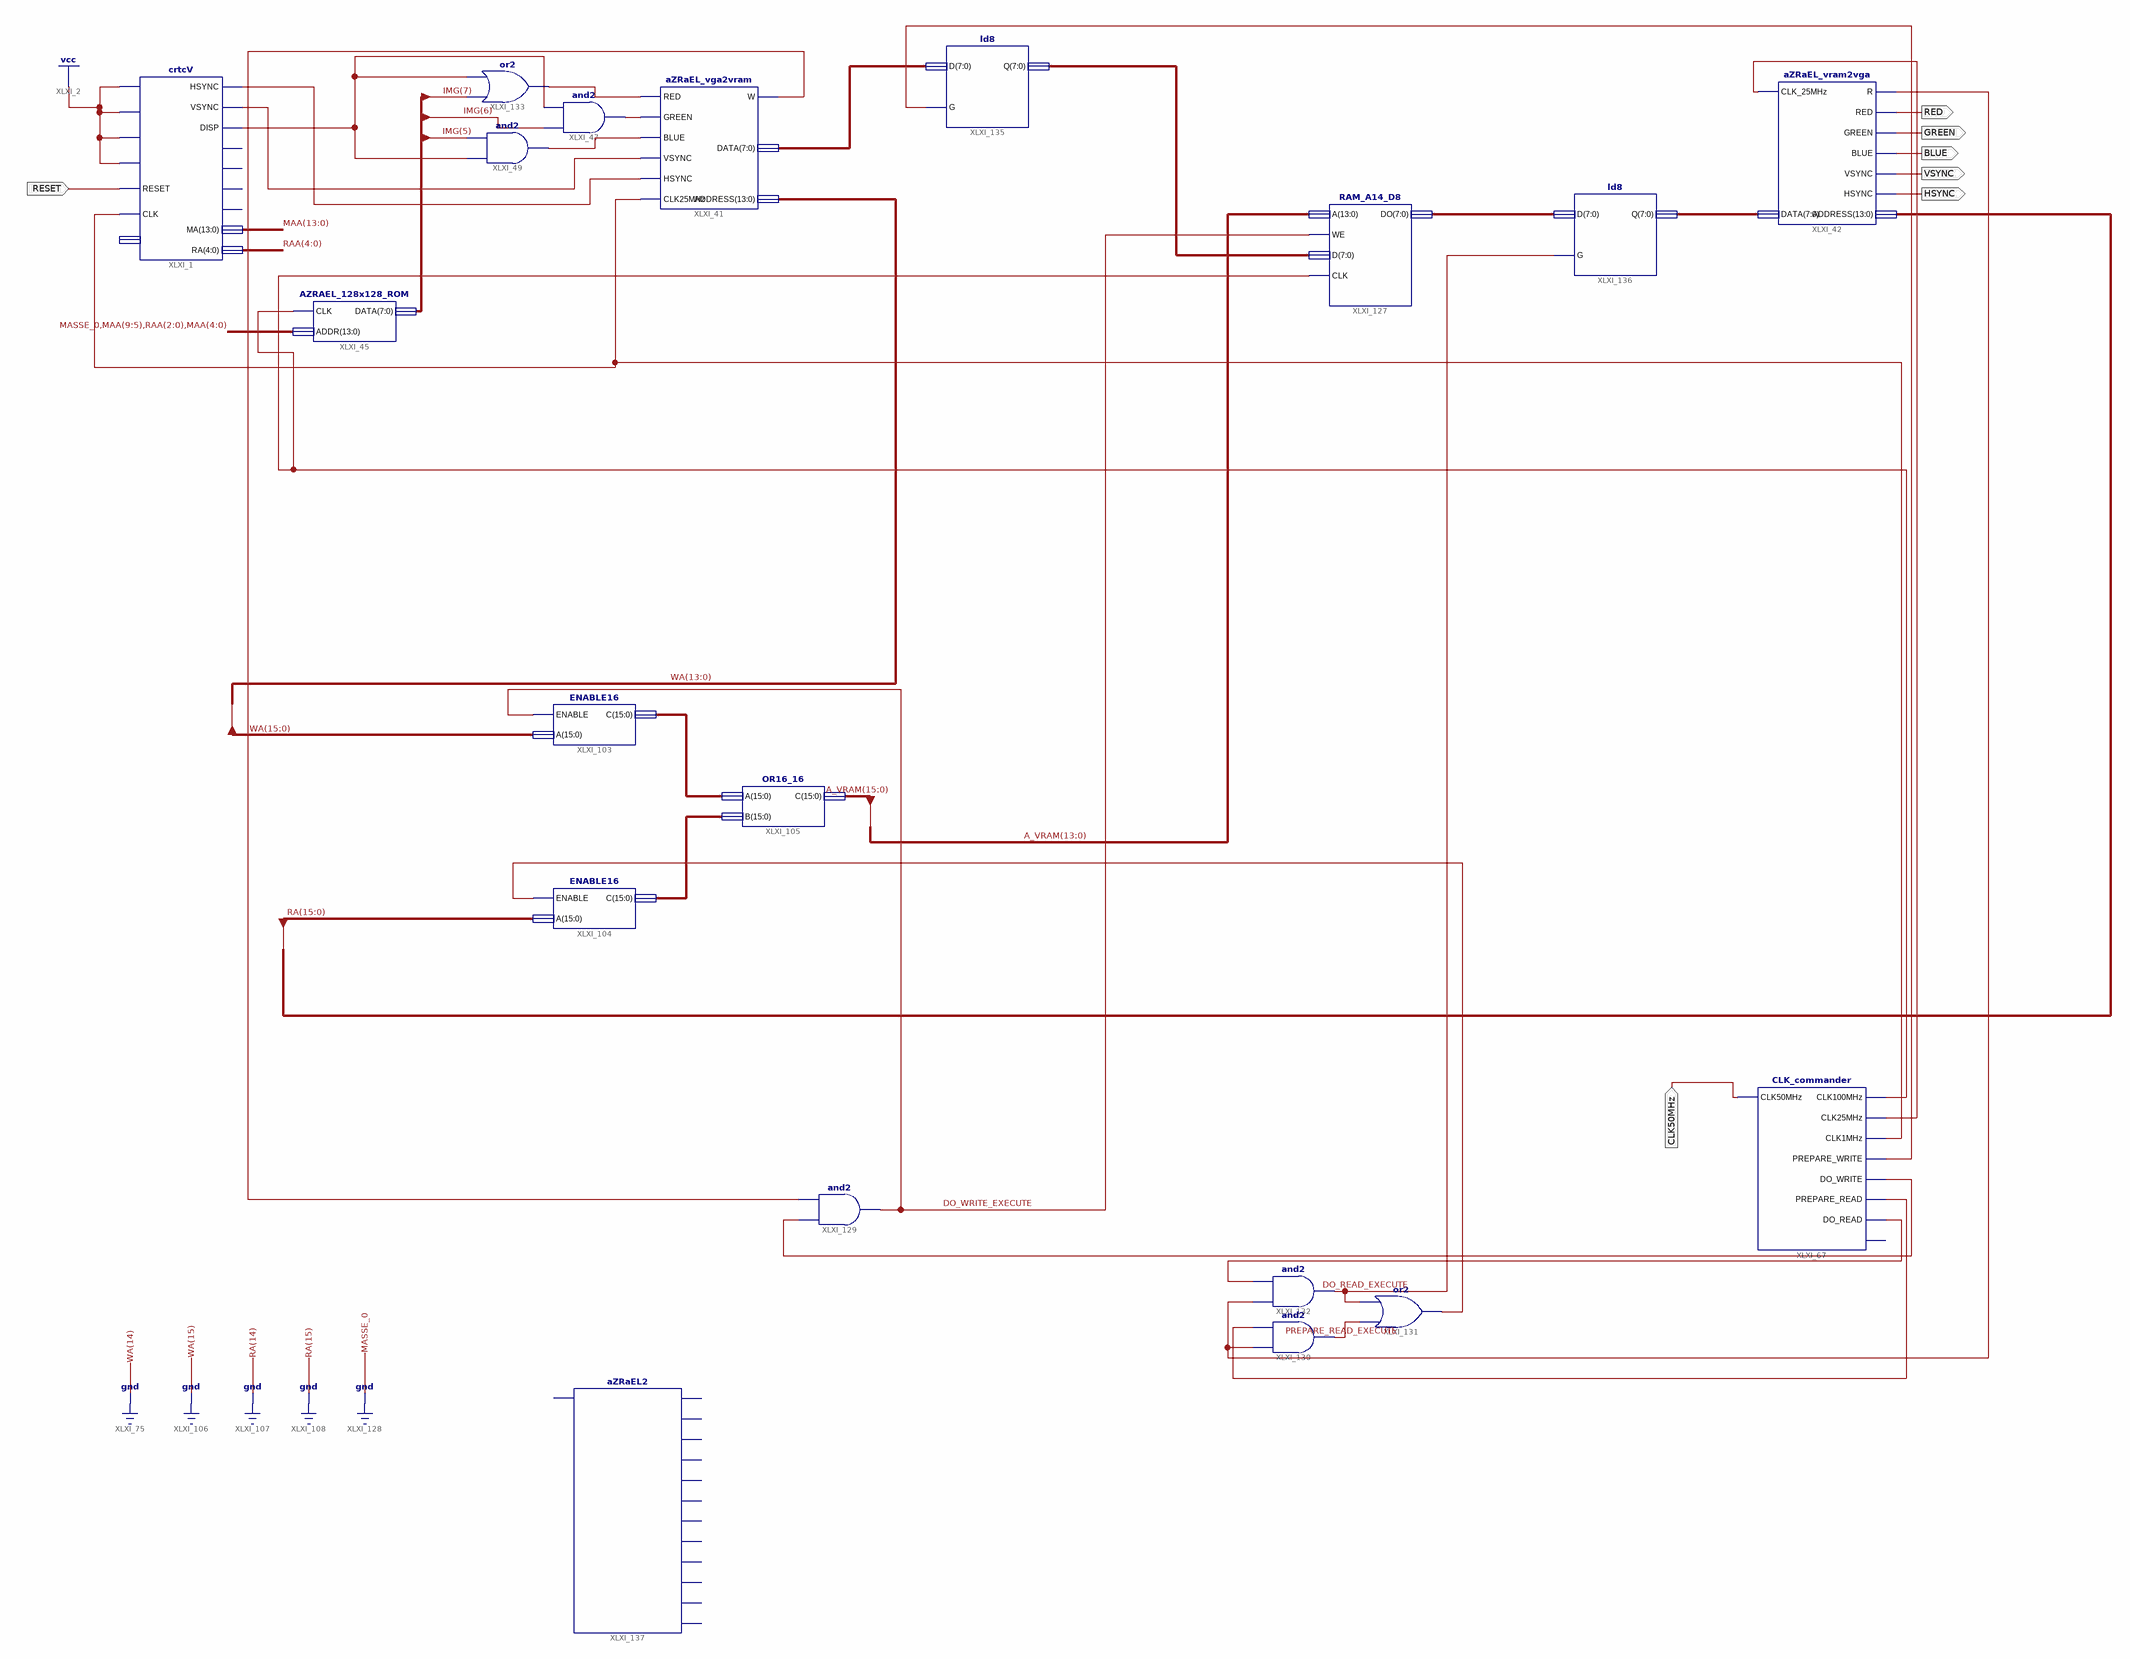
[diagram p0: schematic sheet 1]
// Xilinx ISE schematic aZRaEL_CRTC.sch (spartan3) as structural Verilog: 19 symbols, 7 ports
module aZRaEL_CRTC (
  input  RESET,
  input  CLK50MHz,
  output RED,
  output GREEN,
  output BLUE,
  output VSYNC,
  output HSYNC
);

  wire DO_READ_EXECUTE, DO_WRITE_EXECUTE, PREPARE_READ_EXECUTE, XLXN_81, XLXN_82, XLXN_89, XLXN_90, XLXN_91,
       XLXN_92, XLXN_139, XLXN_141, XLXN_183, XLXN_245, XLXN_246, XLXN_248, XLXN_251, XLXN_253, XLXN_254,
       XLXN_258;
  wire [4:0] RAA;
  wire [7:0] IMG, XLXN_162, XLXN_163, XLXN_238, XLXN_243;
  wire [13:0] MAA, RA, WA;
  wire [15:0] A_VRAM, XLXN_229, XLXN_230;

  crtcV XLXI_1 (
    .IOCLK(1'b1), .RS(1'b1), .CS(1'b1), .RW(1'b1), .RESET(RESET), .CLK(XLXN_139), .HSYNC(XLXN_82),
    .VSYNC(XLXN_81), .DISP(XLXN_92), .MA(MAA), .RA(RAA));  // open: Din, CPCHSYNC, CPCVSYNC, CPCDISP, CPCBLACK
  aZRaEL_vga2vram XLXI_41 (
    .RED(XLXN_91), .GREEN(XLXN_89), .BLUE(XLXN_90), .VSYNC(XLXN_81), .HSYNC(XLXN_82), .CLK25MHz(XLXN_139),
    .W(XLXN_245), .DATA(XLXN_243), .ADDRESS(WA));
  AZRAEL_128x128_ROM XLXI_45 (.CLK(XLXN_183), .ADDR({1'b0, MAA[9:5], RAA[2:0], MAA[4:0]}), .DATA(IMG));
  and XLXI_47 (XLXN_89, IMG[6], XLXN_92);
  and XLXI_49 (XLXN_90, XLXN_92, IMG[5]);
  CLK_commander XLXI_67 (
    .CLK50MHz(CLK50MHz), .CLK100MHz(XLXN_183), .CLK25MHz(XLXN_141), .CLK1MHz(XLXN_139),
    .PREPARE_WRITE(XLXN_258), .DO_WRITE(XLXN_246), .PREPARE_READ(XLXN_248), .DO_READ(XLXN_254));  // open: CLK4MHz
  aZRaEL_vram2vga XLXI_42 (
    .CLK_25MHz(XLXN_141), .DATA(XLXN_162), .R(XLXN_253), .RED(RED), .GREEN(GREEN), .BLUE(BLUE),
    .VSYNC(VSYNC), .HSYNC(HSYNC), .ADDRESS(RA));
  ENABLE16 XLXI_104 (.ENABLE(XLXN_251), .A({2'b00, RA}), .C(XLXN_230));
  ENABLE16 XLXI_103 (.ENABLE(DO_WRITE_EXECUTE), .A({2'b00, WA}), .C(XLXN_229));
  OR16_16 XLXI_105 (.A(XLXN_229), .B(XLXN_230), .C(A_VRAM));
  RAM_A14_D8 XLXI_127 (.D(XLXN_238), .A(A_VRAM[13:0]), .CLK(XLXN_183), .WE(DO_WRITE_EXECUTE), .DO(XLXN_163));
  and XLXI_129 (DO_WRITE_EXECUTE, XLXN_246, XLXN_245);
  and XLXI_130 (PREPARE_READ_EXECUTE, XLXN_253, XLXN_248);
  or XLXI_131 (XLXN_251, PREPARE_READ_EXECUTE, DO_READ_EXECUTE);
  and XLXI_132 (DO_READ_EXECUTE, XLXN_253, XLXN_254);
  or XLXI_133 (XLXN_91, IMG[7], XLXN_92);
  ld8 XLXI_135 (.D(XLXN_243), .G(XLXN_258), .Q(XLXN_238));
  ld8 XLXI_136 (.D(XLXN_163), .G(DO_READ_EXECUTE), .Q(XLXN_162));
  aZRaEL2 XLXI_137 ();  // open: CLK50MHz, RED, GREEN, BLUE, VSYNC, HSYNC, CLK100MHz, DO_READ, CLK25MHz, CLK1MHz, PREPARE_WRITE, DO_WRITE, PREPARE_READ
endmodule
